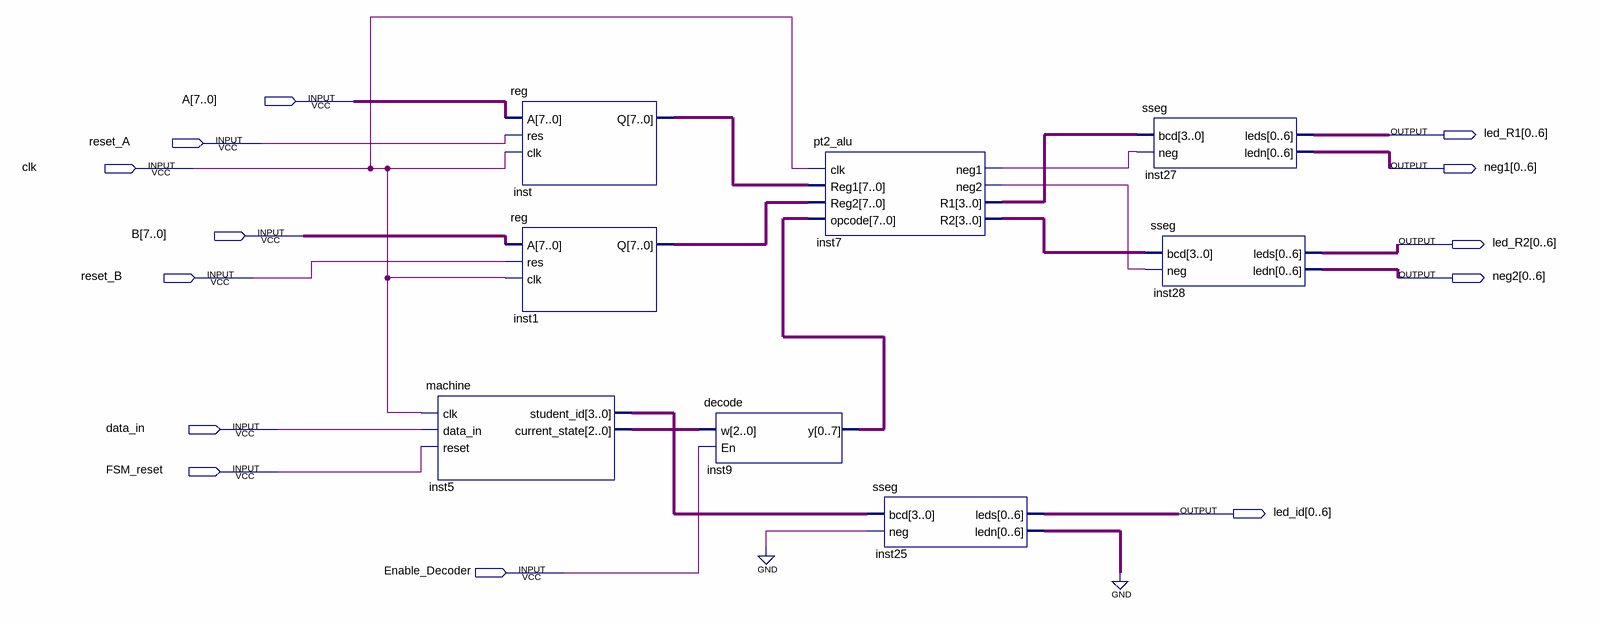
[diagram p0: schematic sheet]
// Quartus schematic FULL2.bdf as structural Verilog: 8 symbols, 13 pins
module FULL2 (
  input  [7:0] A,
  input  reset_A,
  input  clk,
  input  [7:0] B,
  input  reset_B,
  input  data_in,
  input  FSM_reset,
  input  Enable_Decoder,
  output [0:6] led_R1,
  output [0:6] neg1,
  output [0:6] led_R2,
  output [0:6] neg2,
  output [0:6] led_id
);

  wire inst7_neg1, inst7_neg2;
  wire [2:0] inst5_current_state;
  wire [3:0] inst5_student_id, inst7_r1, inst7_r2;
  wire [6:0] inst25_ledn;
  wire [7:0] inst1_q, inst9_y, inst_q;

  machine inst5 (
    .clk(clk), .data_in(data_in), .reset(FSM_reset), .student_id(inst5_student_id),
    .current_state(inst5_current_state));
  \reg  inst (.A(A), .res(reset_A), .clk(clk), .Q(inst_q));
  \reg  inst1 (.A(B), .res(reset_B), .clk(clk), .Q(inst1_q));
  decode inst9 (.w(inst5_current_state), .En(Enable_Decoder), .y(inst9_y));
  pt2_alu inst7 (
    .clk(clk), .Reg1(inst_q), .Reg2(inst1_q), .opcode(inst9_y), .neg1(inst7_neg1), .neg2(inst7_neg2),
    .R1(inst7_r1), .R2(inst7_r2));
  sseg inst25 (.bcd(inst5_student_id), .neg(1'b0), .leds(led_id), .ledn(inst25_ledn));
  sseg inst27 (.bcd(inst7_r1), .neg(inst7_neg1), .leds(led_R1), .ledn(neg1));
  sseg inst28 (.bcd(inst7_r2), .neg(inst7_neg2), .leds(led_R2), .ledn(neg2));
  // also tied to GND on the sheet: {inst25_ledn[0], inst25_ledn[1], inst25_ledn[2], inst25_ledn[3], inst25_ledn[4], inst25_ledn[5], inst25_ledn[6]}
endmodule
